# EAGLE design control-surface-main (EAGLE 6.6.0)
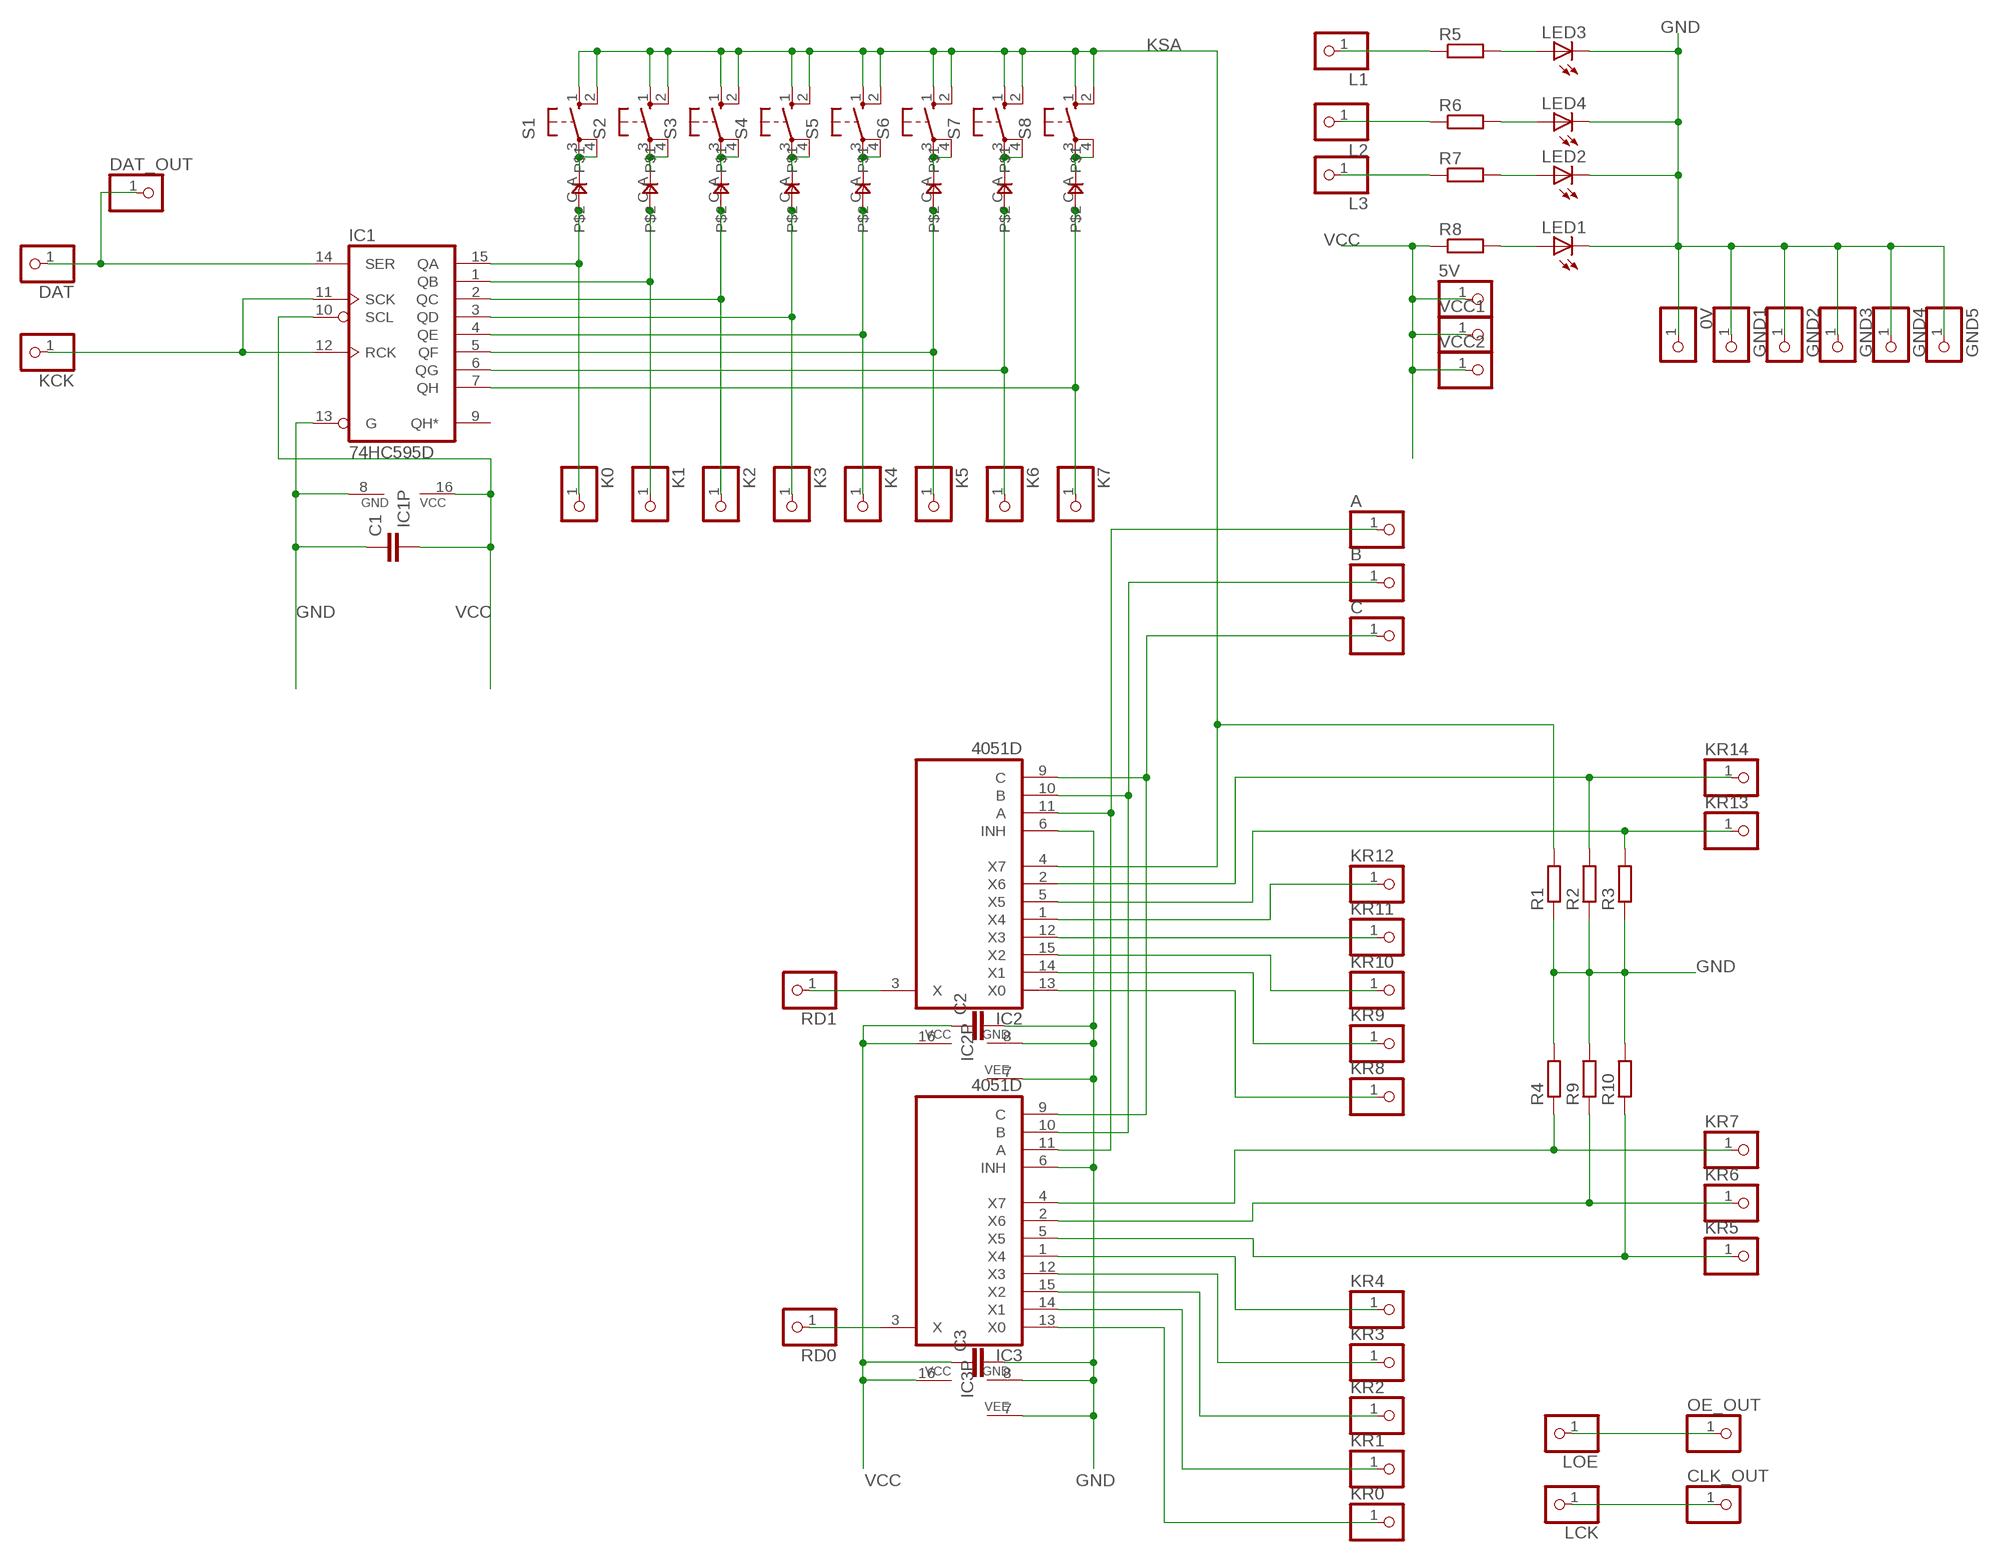
[diagram p0: schematic, sheet 1]

## Parts
0V  PINHD-1X1  [1X01]
5V  PINHD-1X1  [1X01]
A  PINHD-1X1  [1X01]
B  PINHD-1X1  [1X01]
C  PINHD-1X1  [1X01]
C1  C-EUC0805  [C0805]
C2  C-EUC0805  [C0805]
C3  C-EUC0805  [C0805]
CLK_OUT  PINHD-1X1  [1X01]
D1  0805DIODE  [0805DIODE]
D2  0805DIODE  [0805DIODE]
D3  0805DIODE  [0805DIODE]
D4  0805DIODE  [0805DIODE]
D5  0805DIODE  [0805DIODE]
D6  0805DIODE  [0805DIODE]
D7  0805DIODE  [0805DIODE]
D8  0805DIODE  [0805DIODE]
DAT  PINHD-1X1  [1X01]
DAT_OUT  PINHD-1X1  [1X01]
GND1  PINHD-1X1  [1X01]
GND2  PINHD-1X1  [1X01]
GND3  PINHD-1X1  [1X01]
GND4  PINHD-1X1  [1X01]
GND5  PINHD-1X1  [1X01]
IC1  74HC595D  [SO16]
IC2  4051D  [SO16]
IC3  4051D  [SO16]
K0  PINHD-1X1  [1X01]
K1  PINHD-1X1  [1X01]
K2  PINHD-1X1  [1X01]
K3  PINHD-1X1  [1X01]
K4  PINHD-1X1  [1X01]
K5  PINHD-1X1  [1X01]
K6  PINHD-1X1  [1X01]
K7  PINHD-1X1  [1X01]
KCK  PINHD-1X1  [1X01]
KR0  PINHD-1X1  [1X01]
KR1  PINHD-1X1  [1X01]
KR2  PINHD-1X1  [1X01]
KR3  PINHD-1X1  [1X01]
KR4  PINHD-1X1  [1X01]
KR5  PINHD-1X1  [1X01]
KR6  PINHD-1X1  [1X01]
KR7  PINHD-1X1  [1X01]
KR8  PINHD-1X1  [1X01]
KR9  PINHD-1X1  [1X01]
KR10  PINHD-1X1  [1X01]
KR11  PINHD-1X1  [1X01]
KR12  PINHD-1X1  [1X01]
KR13  PINHD-1X1  [1X01]
KR14  PINHD-1X1  [1X01]
L1  PINHD-1X1  [1X01]
L2  PINHD-1X1  [1X01]
L3  PINHD-1X1  [1X01]
LCK  PINHD-1X1  [1X01]
LED1  LED3MM  [LED3MM]
LED2  LED3MM  [LED3MM]
LED3  LED3MM  [LED3MM]
LED4  LED3MM  [LED3MM]
LOE  PINHD-1X1  [1X01]
OE_OUT  PINHD-1X1  [1X01]
R1  R-EU_R0805  [R0805]
R2  R-EU_R0805  [R0805]
R3  R-EU_R0805  [R0805]
R4  R-EU_R0805  [R0805]
R5  R-EU_R0805  [R0805]
R6  R-EU_R0805  [R0805]
R7  R-EU_R0805  [R0805]
R8  R-EU_R0805  [R0805]
R9  R-EU_R0805  [R0805]
R10  R-EU_R0805  [R0805]
RD0  PINHD-1X1  [1X01]
RD1  PINHD-1X1  [1X01]
S1  40-XX  [B3F-40XX]
S2  40-XX  [B3F-40XX]
S3  40-XX  [B3F-40XX]
S4  40-XX  [B3F-40XX]
S5  40-XX  [B3F-40XX]
S6  40-XX  [B3F-40XX]
S7  40-XX  [B3F-40XX]
S8  40-XX  [B3F-40XX]
VCC1  PINHD-1X1  [1X01]
VCC2  PINHD-1X1  [1X01]

## Nets
DAT_IN: DAT.1 DAT_OUT.1 IC1.14(SER)
GND: 0V.1 C1.1 C2.2 C3.2 GND1.1 GND2.1 GND3.1 GND4.1 GND5.1 IC1.8(GND) IC1.13(G) IC2.6(INH) IC2.7(VEE) IC2.8(GND) IC3.6(INH) IC3.7(VEE) IC3.8(GND) LED1.K(C) LED2.K(C) LED3.K(C) LED4.K(C) R1.1 R2.1 R3.1 R4.2 R9.2 R10.2
KSA: IC2.4(X7) R1.2 S1.1(S) S1.2(S1) S2.1(S) S2.2(S1) S3.1(S) S3.2(S1) S4.1(S) S4.2(S1) S5.1(S) S5.2(S1) S6.1(S) S6.2(S1) S7.1(S) S7.2(S1) S8.1(S) S8.2(S1)
N$1: D6.C IC1.15(QA) K0.1
N$2: D6.A S1.3(P) S1.4(P1)
N$3: D7.A S2.3(P) S2.4(P1)
N$4: D8.A S3.3(P) S3.4(P1)
N$5: D1.A S4.3(P) S4.4(P1)
N$6: D2.A S5.3(P) S5.4(P1)
N$7: D3.A S6.3(P) S6.4(P1)
N$8: D4.A S7.3(P) S7.4(P1)
N$9: D5.A S8.3(P) S8.4(P1)
N$10: D7.C IC1.1(QB) K1.1
N$11: D8.C IC1.2(QC) K2.1
N$12: D1.C IC1.3(QD) K3.1
N$13: D2.C IC1.4(QE) K4.1
N$14: D3.C IC1.5(QF) K5.1
N$15: D4.C IC1.6(QG) K6.1
N$16: D5.C IC1.7(QH) K7.1
N$17: C.1 IC2.9(C) IC3.9(C)
N$18: B.1 IC2.10(B) IC3.10(B)
N$19: IC1.11(SCK) IC1.12(RCK) KCK.1
N$20: A.1 IC2.11(A) IC3.11(A)
N$21: LOE.1 OE_OUT.1
N$22: IC2.2(X6) KR14.1 R2.2
N$23: IC2.5(X5) KR13.1 R3.2
N$24: LED3.A R5.2
N$25: LED4.A R6.2
N$26: LED2.A R7.2
N$27: LED1.A R8.2
N$28: IC2.1(X4) KR12.1
N$29: L1.1 R5.1
N$30: L2.1 R6.1
N$31: L3.1 R7.1
N$32: IC2.12(X3) KR11.1
N$33: IC2.15(X2) KR10.1
N$34: IC2.14(X1) KR9.1
N$35: IC2.13(X0) KR8.1
N$36: IC3.4(X7) KR7.1 R4.1
N$37: IC3.2(X6) KR6.1 R9.1
N$38: IC3.5(X5) KR5.1 R10.1
N$39: IC3.1(X4) KR4.1
N$40: IC3.12(X3) KR3.1
N$41: IC3.15(X2) KR2.1
N$42: IC3.14(X1) KR1.1
N$43: IC3.13(X0) KR0.1
N$44: IC3.3(X) RD0.1
N$45: IC2.3(X) RD1.1
N$46: CLK_OUT.1 LCK.1
VCC: 5V.1 C1.2 C2.1 C3.1 IC1.10(SCL) IC1.16(VCC) IC2.16(VCC) IC3.16(VCC) R8.1 VCC1.1 VCC2.1
Unconnected: IC1.9(QH*)

## Library data of the parts
0V 5V A B C CLK_OUT DAT DAT_OUT GND1-GND5 K0 K1-K7 KCK KR0 KR1-KR14 L1-L3 LCK LOE OE_OUT RD0 RD1 VCC1 VCC2 = pinhead:PINHD-1X1: PIN HEADER
C1-C3 = rcl:C-EU: CAPACITOR, European symbol
D1-D8 = jasons_stuff:0805DIODE
IC1 = 74xx-eu:74*595: 8-bit SHIFT REGISTER, output latch
IC2 IC3 = 40xx:4051: 8-channel ANALOG MULTIPLEXER
LED1-LED4 = led:LED: LED OSRAM: - CHIPLED LG R971, LG N971, LY N971, LG Q971, LY Q971, LO R971, LY R971 LH N974, LH R974 LS Q976, LO Q976, LY Q976 LO Q996 - Hyper CHIPLED LW Q18S LB Q993, LB Q99A, LB R99A - SideLED LS A670, LO A670, LY A670, LG A670, LP A670 LB A673, LV A673, LT A673, LW A673 LH A674 LY A675 LS A676, LA A676, LO A676, LY A676, LW A676 LS A679, LY A679, LG A679 - Hyper Micro SIDELED® LS Y876, LA Y876, LO Y876, LY Y876 LT Y87S - SmartLED LW L88C, LW L88S LB L89C, LB L89S, LG L890 LS L89K, LO L89K, LY L89K LS L896, LA L896, LO L896, LY L896 - TOPLED LS T670, LO T670, LY T670, LG T670, LP T670 LSG T670, LSP T670, LSY T670, LOP T670, LYG T670 LG T671, LOG T671, LSG T671 LB T673, LV T673, LT T673, LW T673 LH T674 LS T676, LA T676, LO T676, LY T676, LB T676, LH T676, LSB T676, LW T676 LB T67C, LV T67C, LT T67C, LS T67K, LO T67K, LY T67K, LW E67C LS E67B, LA E67B, LO E67B, LY E67B, LB E67C, LV E67C, LT E67C LW T67C LS T679, LY T679, LG T679 LS T770, LO T770, LY T770, LG T770, LP T770 LB T773, LV T773, LT T773, LW T773 LH T774 LS E675, LA E675, LY E675, LS T675 LS T776, LA T776, LO T776, LY T776, LB T776 LHGB T686 LT T68C, LB T68C - Hyper Mini TOPLED® LB M676 - Mini TOPLED Santana® LG M470 LS M47K, LO M47K, LY M47K Source: http://www.osram.convergy.de LUXEON: - LUMILED® LXK2-PW12-R00, LXK2-PW12-S00, LXK2-PW14-U00, LXK2-PW14-V00 LXK2-PM12-R00, LXK2-PM12-S00, LXK2-PM14-U00 LXK2-PE12-Q00, LXK2-PE12-R00, LXK2-PE12-S00, LXK2-PE14-T00, LXK2-PE14-U00 LXK2-PB12-K00, LXK2-PB12-L00, LXK2-PB12-M00, LXK2-PB14-N00, LXK2-PB14-P00, LXK2-PB14-Q00 LXK2-PR12-L00, LXK2-PR12-M00, LXK2-PR14-Q00, LXK2-PR14-R00 LXK2-PD12-Q00, LXK2-PD12-R00, LXK2-PD12-S00 LXK2-PH12-R00, LXK2-PH12-S00 LXK2-PL12-P00, LXK2-PL12-Q00, LXK2-PL12-R00 Source: www.luxeon.com KINGBRIGHT: KA-3528ASYC Source: www.kingbright.com
R1-R10 = rcl:R-EU_: RESISTOR, European symbol
S1-S8 = switch-omron:40-XX: OMRON SWITCH; MF: OMRON COMPONENTS USA; MPN: B3F-4000; OC_FARNELL: 176434; OC_NEWARK: 36K3105

## Board
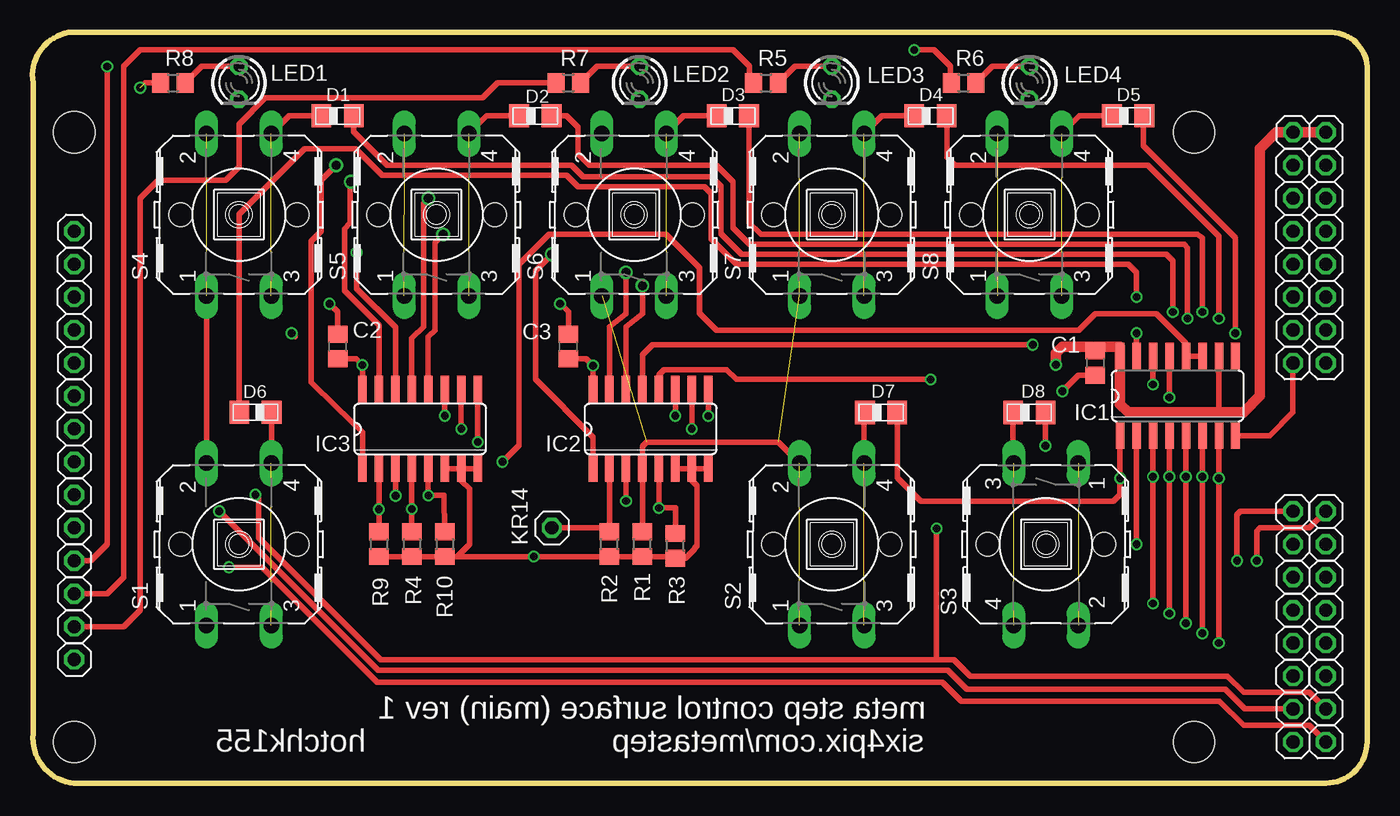
[diagram p1: board, top side]
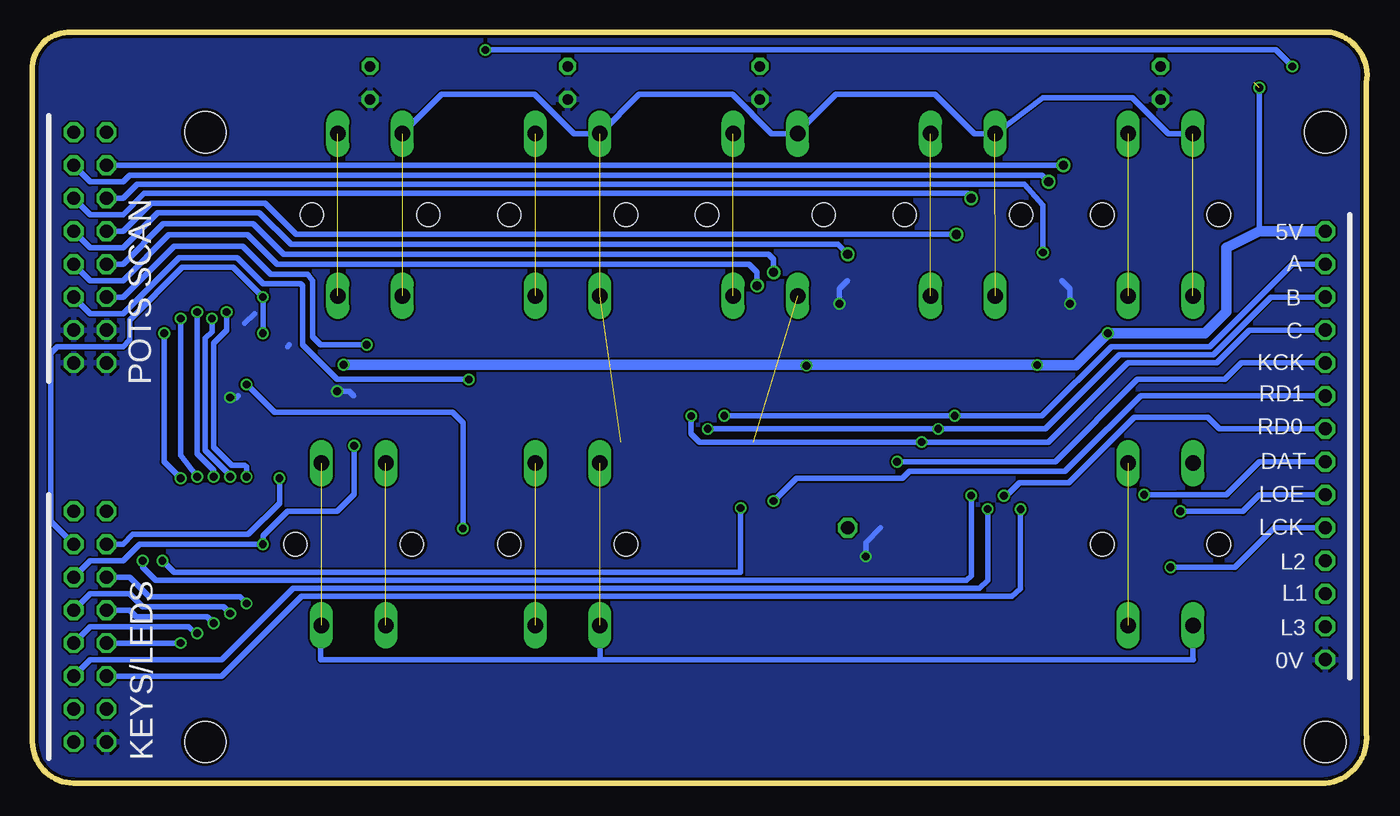
[diagram p2: board, bottom side, seen from below]

Size 102.92 x 57.87 mm. Coordinates in mm from the lower left corner, seen from the top.
Outline: 0.05,3.81 0.05,53.98 arc-90 2.79,57.86 99.95,57.86 arc-90 102.92,55.24 102.92,3.17 arc-90 99.74,0 3.22,0 arc-90 0.05,3.81
Copper layers (1*16): Top 0.035mm / dielectric 1.5mm / Bottom 0.035mm
Design rules "ITEADstudio_DRC": minimum track width 6mil, minimum drill 12mil, track to track 6mil, track to pad 6mil, pad to pad 6mil, via to via 6mil, smd to smd 0mil, copper to edge 10mil, drill to drill 10mil, minimum pad ring 10mil, minimum via ring 6mil, stop-mask expansion 2mil, vias tented up to drill 100mil, thermal gap 10mil
Holes 3.2 mm at 3.22,3.17 3.22,50.16 89.58,50.16 89.58,3.17

### Footprints (pad centres in the part's own frame; a part is rotated, then mirrored left to right if it is on the bottom)
1X01 = drill 1.016 octagon: 1 0,0
C0805 = smd 1.3 x 1.5: 1 -0.95,0; 2 0.95,0
0805DIODE = smd 1.524 x 1.778: A -1.262,-0.005; C 1.238,-0.005
SO16 = smd 0.66 x 2.032: 1 -4.445,-3.073; 2 -3.175,-3.073; 3 -1.905,-3.073; 4 -0.635,-3.073; 5 0.635,-3.073; 6 1.905,-3.073; 7 3.175,-3.073; 8 4.445,-3.073; 9 4.445,3.073; 10 3.175,3.073; 11 1.905,3.073; 12 0.635,3.073; 13 -0.635,3.073; 14 -1.905,3.073; 15 -3.175,3.073; 16 -4.445,3.073
LED3MM = drill 0.813 octagon: A -1.27,0; K 1.27,0
R0805 = smd 1.3 x 1.5: 1 -0.95,0; 2 0.95,0
B3F-40XX = drill 1.194 long: 1 -6.248,2.489; 2 6.248,2.489; 3 -6.248,-2.489; 4 6.248,-2.489 | hole 1.803: 0,-4.496; 0,4.496

### Placement (x,y rotation side)
0V  3.22,9.53 0 top
5V  3.22,42.55 0 top
A  3.22,40 90 top
B  3.22,37.46 90 top
C  3.22,34.92 90 top
C1  81.96,32.38 90 top
C2  23.54,33.66 90 top
C3  41.32,33.66 90 top
CLK_OUT  99.74,3.17 0 top
D1  23.54,51.44 0 top
D2  38.78,51.44 0 top
D3  54.02,51.44 0 top
D4  69.26,51.44 0 top
D5  84.5,51.44 0 top
D6  17.19,28.57 180 top
D7  65.45,28.57 0 top
D8  76.88,28.57 0 top
DAT  3.22,24.77 0 top
DAT_OUT  99.74,5.71 0 top
GND1  97.2,34.92 0 top
GND2  99.74,34.92 0 top
GND3  97.2,32.38 0 top
GND4  99.74,32.38 0 top
GND5  97.2,3.17 0 top
IC1  88.31,29.84 0 top
IC2  47.67,27.3 0 top
IC3  29.89,27.3 0 top
K0  99.74,18.41 0 top
K1  97.2,18.41 0 top
K2  99.74,15.88 0 top
K3  97.2,15.88 0 top
K4  99.74,13.34 0 top
K5  97.2,13.34 0 top
K6  99.74,10.79 0 top
K7  97.2,10.79 0 top
KCK  3.22,32.38 0 top
KR0  99.74,45.09 90 top
KR1  97.2,45.09 90 top
KR2  99.74,47.62 90 top
KR3  97.2,42.55 90 top
KR4  97.2,47.62 90 top
KR5  99.74,20.95 90 top
KR6  97.2,8.26 90 top
KR7  99.74,8.26 90 top
KR8  97.2,37.46 90 top
KR9  99.74,40 90 top
KR10  97.2,40 90 top
KR11  99.74,37.46 90 top
KR12  99.74,42.55 90 top
KR13  97.2,20.95 90 top
KR14  40.05,19.68 90 top
L1  3.22,14.61 0 top
L2  3.22,17.14 0 top
L3  3.22,12.07 0 top
LCK  3.22,19.68 0 top
LED1  15.92,53.98 270 top
LED2  46.83,53.98 270 top
LED3  61.64,53.98 270 top
LED4  76.88,53.98 270 top
LOE  3.22,22.22 0 top
OE_OUT  97.2,5.71 0 top
R1  47.04,18.41 90 top
R2  44.5,18.41 90 top
R3  49.58,18.29 90 top
R4  29.26,18.41 270 top
R5  56.56,53.98 0 top
R6  71.8,53.98 0 top
R7  41.32,53.98 0 top
R8  10.84,53.98 0 top
R9  26.72,18.41 270 top
R10  31.8,18.41 270 top
RD0  3.22,27.3 90 top
RD1  3.22,29.84 90 top
S1  15.92,18.41 90 top
S2  61.64,18.41 90 top
S3  78.15,18.41 270 top
S4  15.92,43.81 90 top
S5  31.16,43.81 90 top
S6  46.4,43.81 90 top
S7  61.64,43.81 90 top
S8  76.88,43.81 90 top
VCC1  97.2,50.16 0 top
VCC2  99.74,50.16 0 top

### Tracks (layer width: path | path; a pad name or v marks a point on that pad's centre or on a via)
DAT_IN  (via drill 0.6)
  Top 0.406: 69.75,9.53 26.85,9.53 17.45,18.92 17.45,21.97 v17.19,22.22 | 69.75,9.53 71.04,9.53 72.31,8.26 92.12,8.26 93.39,6.99 98.47,6.99 DAT_OUT.1 | v69.72,19.63 69.72,9.55 69.75,9.53 | v86.41,30.73 IC1.14
  Bottom 0.406: v69.72,19.63 69.72,27.76 70.53,28.57 84.25,28.57 v86.41,30.73 | DAT.1 8.3,24.77 10.84,22.22 14.65,22.22 v17.19,22.22
GND  (via drill 0.6)
  Top 0.406: IC3.6 IC3.7 | IC3.7 IC3.8 | IC2.6 IC2.7 | IC2.7 IC2.8 | R9.2 R4.2 R10.2 32.75,17.46 | 32.75,17.46 33.7,18.41 33.7,22.68 33.07,23.32 IC3.7 | IC2.7 50.87,24.21 50.87,23.32 51.25,22.94 51.25,18.29 51.05,18.08 51.05,18.03 50.36,17.34 R3.1 49.45,17.46 R1.1 R2.1 | R2.1 32.75,17.46 | R2.1 38.67,17.46 v38.66,17.47 | C1.1 80.66,31.44 v79.42,30.2 | IC1.8 95.4,26.77 97.2,28.57 GND3.1 | IC1.13 v87.68,29.72 | C2.2 23.54,36.32 v22.91,36.96 | C3.2 41.32,36.32 v40.69,36.96
  Bottom 0.406: 83.11,33.81 83.11,33.78 83.23,33.66 | v38.66,17.47 38.66,18.54 37.51,19.68 | v79.42,30.2 78.51,30.2 78.15,29.84 | 86.54,35.43 85.77,36.2 | v87.68,29.72 87.17,29.72 87.04,29.84 | v22.91,36.96 22.91,38.1 23.54,38.73 | v40.69,36.96 40.69,38.1 40.05,38.73
  pour Bottom: -6.94,57.78 -6.94,-4.45 111.17,-4.45 111.17,57.78
KSA  (8 unrouted)
  Top 0.406: R1.2 IC2.4 47.04,25.98 47.34,26.29 57.53,26.29 S2.2 | S1.2 S4.1 | 13.38,50.11 S4.2
  Bottom 0.406: S1.1 13.43,9.58 13.38,9.53 59.1,9.53 | 59.1,9.53 80.69,9.53 80.69,12.12 S3.2 | S2.1 59.15,9.58 59.1,9.53 | 59.1,50.11 S7.2 | S7.2 61.16,50.06 64.18,53.09 71.37,53.09 S8.2 | S7.2 56.13,53.09 48.94,53.09 45.92,50.06 S6.2 43.91,50.11 40.94,53.09 33.32,53.09 30.27,50.04 28.7,50.04 S5.2 25.02,52.83 18.08,52.83 15.31,50.06 S4.2
N$1  (via drill 0.6)
  Top 0.406: D6.C 15.96,43.85 21,48.89 24.94,48.89 26.97,46.86 41.2,46.86 42.09,45.97 51.81,45.97 52.32,45.47 52.32,41.96 54.28,40 84.5,40 85.14,39.37 v85.14,37.46 | IC1.15 v85.14,34.67
  Bottom 0.406: v85.14,34.67 v85.14,37.46 87.42,39.75 91.36,39.75 95.43,35.69 95.43,34.16 95.93,33.66 101.01,33.66 101.52,33.15 101.52,20.19 K0.1
N$2  (1 unrouted)
  Top 0.406: D6.A 18.46,24.71 S1.4
N$3  (1 unrouted)
  Top 0.406: S2.4 64.13,28.51 D7.A
N$4  (1 unrouted)
  Top 0.406: D8.A 75.62,24.71 S3.3
N$5  (1 unrouted)
  Top 0.406: D1.A 19.78,51.43 S4.4
N$6  (1 unrouted)
  Top 0.406: D2.A 35.02,51.43 S5.4
N$7  (1 unrouted)
  Top 0.406: D3.A 50.21,51.43 48.94,50.16 48.94,50.11 S6.4
N$8  (1 unrouted)
  Top 0.406: D4.A 65.5,51.43 S7.4
N$9  (1 unrouted)
  Top 0.406: D5.A 80.74,51.43 S8.4
N$10  (via drill 0.6)
  Top 0.406: IC1.1 v83.87,23.49 83.87,22.22 83.36,21.72 68.5,21.72 66.69,23.53 D7.C
  Bottom 0.406: K1.1 95.93,18.41 95.17,19.18 86.28,19.18 83.87,21.59 v83.87,23.49
N$11  (via drill 0.6)
  Top 0.406: IC1.2 v85.14,18.41 | D8.C 78.12,26.03 v78.1,26.01
  Bottom 0.406: v78.1,26.01 78.1,22.28 79.42,20.95 83.23,20.95 85.14,19.05 v85.14,18.41 94.66,18.41 95.93,17.14 98.47,17.14 K2.1
N$12  (via drill 0.6)
  Top 0.406: v86.41,13.84 v86.41,23.62 IC1.3 | D1.C 24.78,50.2 27.35,47.62 41.58,47.62 42.47,46.74 52.37,46.74 53.11,46 53.11,42.34 54.68,40.77 87.42,40.77 87.93,40.26 v87.93,36.32
  Bottom 0.406: K3.1 95.43,15.88 93.9,14.35 86.92,14.35 v86.41,13.84 | v86.41,23.62 86.41,24.38 86.54,24.51 87.55,24.51 88.95,25.91 88.95,33.91 87.93,34.92 v87.93,36.32
N$13  (via drill 0.6)
  Top 0.406: v87.68,13.08 v87.68,23.62 IC1.4 | D2.C 41.2,51.43 42.09,50.55 42.09,48.51 42.97,47.62 52.75,47.62 54.02,46.35 54.02,42.8 55.29,41.53 88.82,41.53 89.08,41.27 v89.08,35.81
  Bottom 0.406: K4.1 98.47,14.61 95.43,14.61 94.41,13.59 88.19,13.59 v87.68,13.08 | v87.68,23.62 87.68,23.75 89.58,25.65 89.58,34.29 89.08,34.8 v89.08,35.81
N$14  (via drill 0.6)
  Top 0.406: v88.95,12.32 v88.95,23.62 IC1.5 | D3.C 55.26,43.21 56.18,42.29 89.84,42.29 90.22,42.04 v90.22,36.32
  Bottom 0.406: K5.1 95.43,13.34 94.92,12.83 89.46,12.83 v88.95,12.32 | v88.95,23.62 88.95,24.13 90.22,25.4 v90.22,36.32
N$15  (via drill 0.6)
  Top 0.406: v90.22,11.56 v90.22,23.62 IC1.6 | D4.C 70.53,51.4 70.53,48.26 71.17,47.62 86.03,47.62 91.49,42.16 v91.49,35.81
  Bottom 0.406: K6.1 98.47,12.07 90.85,12.07 90.35,11.56 v90.22,11.56 | v90.22,23.62 91.49,25.27 v91.49,35.81
N$16  (via drill 0.6)
  Top 0.406: v91.49,10.79 v91.49,23.49 IC1.7 | v92.76,34.67 92.76,42.04 85.65,49.15 85.65,51.34 D5.C
  Bottom 0.406: v91.49,10.79 K7.1 | v92.76,34.67 92.76,24.77 v91.49,23.49
N$17  (via drill 0.6)
  Top 0.406: IC3.9 v34.34,26.29 | IC2.9 v52.12,28.3
  Bottom 0.406: v52.12,28.3 52.12,26.92 51.48,26.29 v34.34,26.29 24.56,26.29 18.46,32.38 11.61,32.38 9.07,34.92 C.1
N$18  (via drill 0.6)
  Top 0.406: IC2.10 v50.85,27.3 | v33.07,27.3 IC3.10
  Bottom 0.406: v50.85,27.3 v33.07,27.3 24.81,27.3 19.1,33.02 11.86,33.02 7.41,37.46 B.1
N$19  (via drill 0.6)
  Top 0.406: IC1.11 IC1.12 88.95,33.91 86.66,36.2 81.96,36.2 80.69,34.92 52.75,34.92 51.46,36.22 51.46,39.73 48.87,42.32 39.82,42.32 37.51,40 37.51,26.04 v36.24,24.77
  Bottom 0.406: v36.24,24.77 24.05,24.77 17.7,31.12 10.97,31.12 9.7,32.38 KCK.1
N$20  (via drill 0.6)
  Top 0.406: IC2.11 v49.58,28.32 | v31.8,28.32 IC3.11
  Bottom 0.406: v49.58,28.32 v31.8,28.32 25.07,28.32 19.73,33.66 12.11,33.66 5.76,40 A.1
N$21  (via drill 0.6)
  Top 0.406: OE_OUT.1 97.18,5.74 93.5,5.74 92,7.24 72.06,7.24 70.61,8.69 26.67,8.69 v14.4,20.95
  Bottom 0.406: LOE.1 8.3,22.22 9.57,20.95 v14.4,20.95
N$22
  Top 0.406: IC2.2 R2.2 44.18,19.68 KR14.1
N$23  (via drill 0.6)
  Top 0.406: IC2.5 v48.31,21.21 49.58,21.21 R3.2 | v92.89,17.14 92.89,20.7 93.14,20.95 KR13.1
  Bottom 0.406: v48.31,21.21 48.31,16.26 92,16.26 v92.89,17.14
N$24
  Top 0.406: LED3.A 58.78,55.24 R5.2
N$25
  Top 0.406: LED4.A 74.02,55.24 R6.2
N$26
  Top 0.406: LED2.A 43.54,55.24 R7.2
N$27
  Top 0.406: LED1.A 13.06,55.24 R8.2
N$28  (via drill 0.7)
  Top 0.406: IC2.1 43.23,26.67 38.78,31.12 38.78,39.5 v40.05,40.77
  Bottom 0.406: KR12.1 98.47,41.27 95.93,41.27 93.24,43.97 85.42,43.97 82.98,41.53 40.82,41.53 v40.05,40.77
N$29
  Top 0.406: L1.1 5.76,14.61 7.03,15.88 7.03,55.24 8.3,56.52 54.02,56.52 55.29,55.24 55.29,54.3 R5.1
N$30  (via drill 0.6)
  Top 0.406: L2.1 4.49,17.14 5.76,18.41 v5.76,55.24 | v67.99,56.52 69.52,56.52 70.79,55.24 70.79,54.04 R6.1
  Bottom 0.406: v5.76,55.24 7.03,56.52 v67.99,56.52
N$31
  Top 0.406: L3.1 7.03,12.07 8.3,13.34 8.3,45.09 9.7,46.48 14.91,46.48 15.92,47.5 15.92,50.8 17.96,52.83 34.72,52.83 35.86,53.98 R7.1
N$32  (via drill 0.6)
  Top 0.406: v69.26,31.12 54.28,31.12 53.52,31.88 48.69,31.88 48.31,31.5 IC2.12
  Bottom 0.406: KR11.1 98.47,36.2 95.93,36.2 91.62,40.51 87.15,40.51 85.11,38.48 82.22,38.48 82.09,38.35 82.09,33.78 79.42,31.12 v69.26,31.12
N$33  (via drill 0.7)
  Top 0.406: IC2.15 44.5,35.18 45.77,36.2 v45.77,39.37
  Bottom 0.406: v45.77,39.37 45.77,40.39 46.15,40.77 83.56,40.77 85.9,43.1 92.83,43.1 95.93,40 KR10.1
N$34  (via drill 0.7)
  Top 0.406: IC2.14 45.77,35.18 47.04,36.2 v47.04,38.35
  Bottom 0.406: v47.04,38.35 47.04,39.37 47.67,40 84.05,40 86.31,42.27 92.4,42.27 95.93,38.73 98.47,38.73 KR9.1
N$35  (via drill 0.6)
  Top 0.406: IC2.13 47.04,33.02 47.8,33.78 v77.14,33.78
  Bottom 0.406: KR8.1 95.93,37.46 92,41.4 86.71,41.4 84.55,39.24 81.71,39.24 81.33,38.73 81.33,34.42 80.69,33.78 v77.14,33.78
N$36  (via drill 0.6)
  Top 0.406: R4.1 v29.26,21.13 IC3.4
  Bottom 0.406: v29.26,21.13 29.26,15.62 29.89,15.01 82.83,15.01 88.31,9.53 98.47,9.53 KR7.1
N$37  (via drill 0.6)
  Top 0.406: R9.1 v26.72,21.11 IC3.2
  Bottom 0.406: v26.72,21.11 26.72,14.99 27.38,14.4 82.17,14.4 88.31,8.26 KR6.1
N$38  (via drill 0.6)
  Top 0.406: R10.1 31.75,22.17 v30.53,22.17 IC3.5 | v94.41,17.14 94.41,19.43 94.66,19.68 98.47,19.68 KR5.1
  Bottom 0.406: v30.53,22.17 30.53,16 30.91,15.62 93.39,15.62 94.41,16.64 v94.41,17.14
N$39  (via drill 0.7)
  Top 0.406: IC3.1 25.45,27.05 23.39,29.03 21.51,30.91 21.51,41.78 22.27,42.55 22.27,46.48 v23.42,47.62
  Bottom 0.406: KR4.1 v23.42,47.62
N$40  (via drill 0.7)
  Top 0.406: IC3.12 30.53,34.42 31.04,34.92 31.04,41.66 v31.67,42.29
  Bottom 0.406: v31.67,42.29 82.57,42.29 84.99,44.7 93.77,44.7 95.93,42.55 KR3.1
N$41  (via drill 0.7)
  Top 0.406: IC3.15 26.72,35.31 24.08,37.95 24.08,42.75 24.51,43.18 24.51,46.3 v24.56,46.35
  Bottom 0.406: v24.56,46.35 25.07,46.86 95.43,46.86 95.93,46.35 98.47,46.35 KR2.1
N$42  (via drill 0.6)
  Top 0.406: IC3.14 27.99,35.13 25.02,38.1 25.02,40.39 v24.99,40.89
  Bottom 0.406: v24.99,40.89 24.99,44.55 25.58,45.21 26.44,46.18 94.84,46.18 95.93,45.09 KR1.1
N$43  (via drill 0.7)
  Top 0.406: IC3.13 29.26,34.29 30.15,35.18 30.15,44.7 v30.53,45.09
  Bottom 0.406: v30.53,45.09 30.78,45.47 94.28,45.47 95.93,43.81 98.47,43.81 KR0.1
N$44  (via drill 0.6)
  Top 0.406: IC3.3 27.99,22.17 v28.01,22.15
  Bottom 0.406: v28.01,22.15 27.81,22.15 26.82,23.14 23.01,23.14 17.93,28.22 12.29,28.22 11.38,27.3 RD0.1
N$45  (via drill 0.6)
  Top 0.406: v45.77,21.74 IC2.3
  Bottom 0.406: v45.77,21.74 44.02,23.49 35.84,23.49 35.3,24.03 23.29,24.03 20.01,27.3 19.99,27.3 17.45,29.84 RD1.1
N$46  (via drill 0.6)
  Top 0.406: CLK_OUT.1 98.47,4.44 93.39,4.44 91.54,6.3 71.65,6.3 70.18,7.77 26.57,7.77 17.7,16.64 v15.16,16.64
  Bottom 0.406: LCK.1 7.16,19.68 10.21,16.64 v15.16,16.64
VCC  (via drill 0.6)  (1 unrouted)
  Top 0.406: v43.23,32.18 43.2,32.21 | 82.38,32.92 C1.2 81.9,33.27 | IC1.10 91.46,32.89 91.46,31.73 91.49,31.7 91.49,28.7 93.27,28.7 93.39,28.57 | IC2.16 v43.23,32.18 | 20.24,34.42 v19.99,34.67 | C2.1 24.98,32.7 v25.45,32.23 IC3.16 | C3.1 42.71,32.7 v43.23,32.18 | R8.1 8.68,53.98
  Top 0.813: VCC2.1 VCC1.1 95.93,50.16 94.66,48.89 94.66,29.84 93.39,28.57 84.5,28.57 83.87,29.21 IC1.16 83.87,33.66 81.96,33.66 C1.2 81.64,33.66 79.42,33.66 78.92,33.15 v78.92,32.26
  Bottom 0.406: 43.28,32.23 v43.23,32.18 | 43.18,32.23 43.2,32.21 | v8.3,53.59 8.3,42.55
  Bottom 0.813: v43.23,32.18 43.18,32.23 v25.45,32.23 25.42,32.21 22.45,32.21 v19.99,34.67 12.49,34.67 10.84,36.32 10.84,41.27 8.3,42.55 5V.1 | 43.28,32.23 78.89,32.23 v78.92,32.26

### Text on the board
tPlace: meta step control surface (main) rev 1 | hotchk155 | six4pix.com/metastep
bPlace: POTS SCAN | KEYS/LEDS